# EAGLE design Hub_01 (EAGLE 9.1.1)
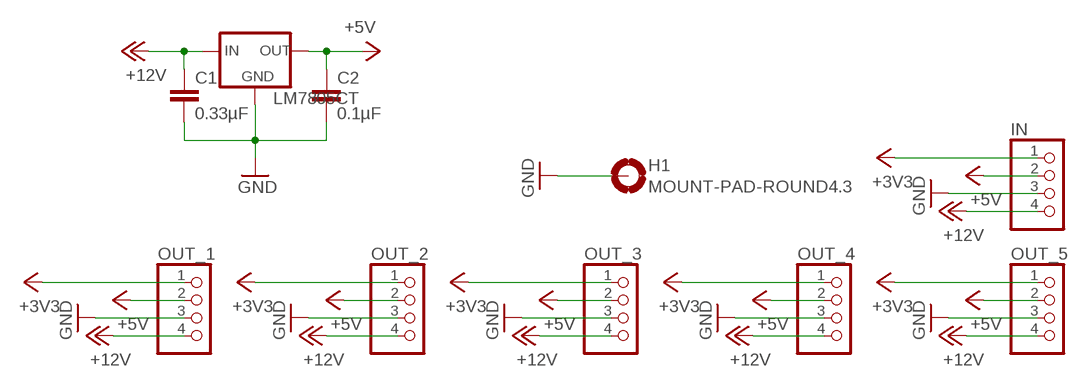
[diagram p0: schematic, sheet 1]

## Parts
C1  0.33µF  C-EU025-024X044  [C025-024X044]
C2  0.1µF  C-EU025-024X044  [C025-024X044]
H1  MOUNT-PAD-ROUND4.3  [4,3-PAD]
IN  PINHD-1X4  [1X04]
LM7805CT  78XXS  [78XXS]
OUT_1  PINHD-1X4  [1X04]
OUT_2  PINHD-1X4  [1X04]
OUT_3  PINHD-1X4  [1X04]
OUT_4  PINHD-1X4  [1X04]
OUT_5  PINHD-1X4  [1X04]

## Nets
+3V3: IN.1 OUT_1.1 OUT_2.1 OUT_3.1 OUT_4.1 OUT_5.1
+5V [5V]: C2.1 IN.2 LM7805CT.OUT OUT_1.2 OUT_2.2 OUT_3.2 OUT_4.2 OUT_5.2
+12V [12V]: C1.1 IN.4 LM7805CT.IN OUT_1.4 OUT_2.4 OUT_3.4 OUT_4.4 OUT_5.4
GND [GND]: C1.2 C2.2 H1.B4,3(MOUNT) IN.3 LM7805CT.GND OUT_1.3 OUT_2.3 OUT_3.3 OUT_4.3 OUT_5.3

## Library data of the parts
C1 C2 = resistor:C-EU: CAPACITOR, European symbol
H1 = holes:MOUNT-PAD-ROUND: MOUNTING PAD, round
IN OUT_1-OUT_5 = pinhead:PINHD-1X4: PIN HEADER
LM7805CT = v-reg:78XXS: VOLTAGE REGULATOR

## Net classes
0 3V3: width 0.203 mm, drill 0.203 mm, clearance 0.203 mm
1 GND: width 0.203 mm, clearance 0.203 mm
2 12V: width 0.813 mm, clearance 0.406 mm
3 5V: width 0.406 mm, clearance 0.203 mm

## Board
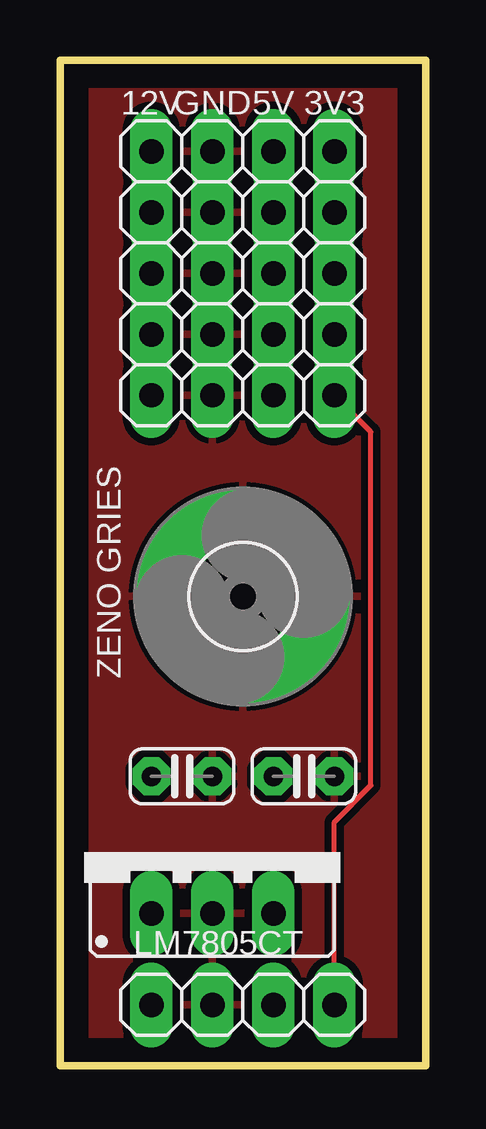
[diagram p1: board, top side]
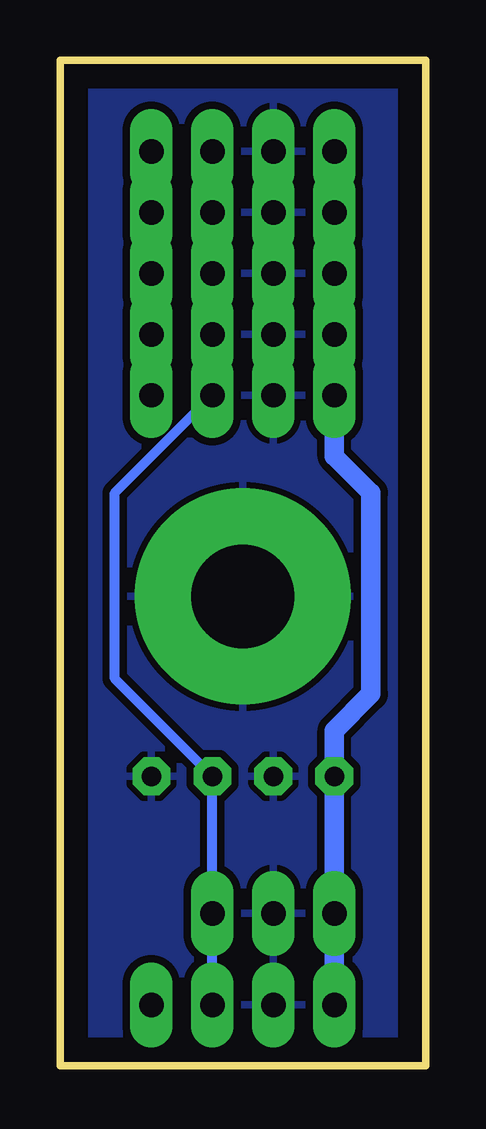
[diagram p2: board, bottom side, seen from below]

Size 15.24 x 41.91 mm. Coordinates in mm from the lower left corner, seen from the top.
Outline: 0,0 15.24,0 15.24,41.91 0,41.91 0,0
Copper layers (1*16): Top 0.035mm / dielectric 1.5mm / Bottom 0.035mm
Design rules "default *": minimum track width 6mil, minimum drill 0.35mm, track to track 6mil, track to pad 6mil, pad to pad 6mil, via to via 6mil, smd to smd 6mil, copper to edge 40mil, drill to drill 6mil, minimum pad ring 15mil, minimum via ring 8mil, stop-mask expansion 4mil, vias tented up to drill 0mil, thermal gap 10mil

### Footprints (pad centres in the part's own frame; a part is rotated, then mirrored left to right if it is on the bottom)
C025-024X044 = drill 0.813 octagon: 1 -1.27,0; 2 1.27,0
4,3-PAD = drill 4.3 pad 9: B4,3 0,0
1X04 = drill 1.016 long: 1 -3.81,0; 2 -1.27,0; 3 1.27,0; 4 3.81,0
78XXS = drill 1.016 long: GND 0,-2.54; IN -2.54,-2.54; OUT 2.54,-2.54

### Placement (x,y rotation side)
C1  5.08,12.06 0 top
C2  10.16,12.06 0 top
H1  7.62,19.56 0 top
IN  7.62,2.54 180 top
LM7805CT  6.35,8.89 0 top
OUT_1  7.62,27.94 180 top
OUT_2  7.62,30.48 180 top
OUT_3  7.62,33.02 180 top
OUT_4  7.62,35.56 180 top
OUT_5  7.62,38.1 180 top

### Tracks (layer width: path | path; a pad name or v marks a point on that pad's centre or on a via)
+3V3
  Top 0.203: IN.1 11.43,10.16 12.95,11.68 12.95,26.42 OUT_1.1 OUT_2.1 OUT_3.1 OUT_4.1 OUT_5.1
+5V
  Bottom 0.406: IN.2 LM7805CT.OUT C2.1 12.95,16.13 12.95,23.88 OUT_1.2 OUT_2.2 OUT_3.2 OUT_4.2 OUT_5.2
+12V
  Bottom 0.813: IN.4 LM7805CT.IN C1.1 3.81,13.97 2.29,15.49 2.29,23.88 3.81,25.4 OUT_1.4 OUT_2.4 OUT_3.4 OUT_4.4 OUT_5.4
GND
  pour Top (isolate 0.305): 0,0 0,40.64 15.24,40.64 15.24,0
  pour Bottom (isolate 0.305): 0,0 0,40.64 15.24,40.64 15.24,0

### Text on the board
tPlace: 12V | GND | 5V | 3V3 | ZENO GRIES